# Altium schematic sheet NAND_Flash.SchDoc
size 209 x 297 mm; SheetNumber: 4; SheetTotal: 14; CmpIndex: 73; SymIndex: 29
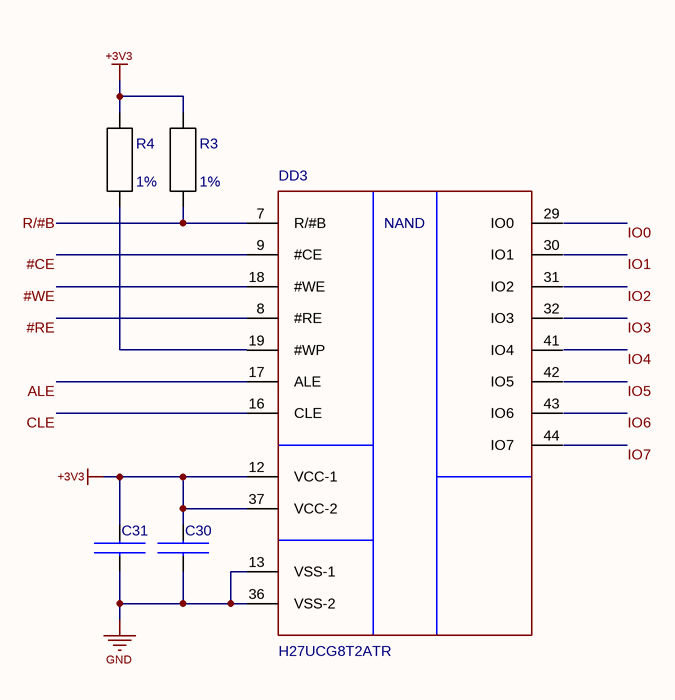
[diagram p0: NAND_Flash.SchDoc]

## Parts
C30  0402-0.1uF-50V-10%-X7R  (value not drawn)
C31  0402-0.1uF-50V-10%-X7R  (value not drawn)
DD3  H27UCG8T2ATR
R3  Tolerance: 1%  (hidden comment: 0402-10k-1%-1/16 W-100ppm)
R4  Tolerance: 1%  (hidden comment: 0402-10k-1%-1/16 W-100ppm)

## Nets
+3V3: C30.2 C31.2 DD3.12(VCC-1) DD3.37(VCC-2) R3.2 R4.2
GND: C30.1 C31.1 DD3.13(VSS-1) DD3.36(VSS-2)
#CE: DD3.9(#CE)
#RE: DD3.8(#RE)
#WE: DD3.18(#WE)
ALE: DD3.17(ALE)
CLE: DD3.16(CLE)
IO0: DD3.29(IO0)
IO1: DD3.30(IO1)
IO2: DD3.31(IO2)
IO3: DD3.32(IO3)
IO4: DD3.41(IO4)
IO5: DD3.42(IO5)
IO6: DD3.43(IO6)
IO7: DD3.44(IO7)
R/#B: DD3.7(R/#B) R3.1
NetDD3_19: DD3.19(#WP) R4.1

## Notes on the sheet
- Лист
- Изм.
- № Докум.
- Подп.
- Дата
- (in symbol H27UCG8T2ATR) NAND

## Library data of the parts
C30 = 0402-0.1uF-50V-10%-X7R: Cell Name: 0402_CAPC100X50X55L25N; CmpIndex: 19; Ref Designator: C30; SymIndex: 25; Tolerance: 10%; Orientation: 1 = 1; Part Label: 0402-0.1uF-50V-10%-X7R; Part Name: 0402-0.1uF-50V-10%-X7R; Part Number NP: 0402-0.1uF-50V-10%-X7R; Part Number: 0402-0.1uF-50V-10%-X7R
C31 = 0402-0.1uF-50V-10%-X7R: Cell Name: 0402_CAPC100X50X55L25N; CmpIndex: 20; Ref Designator: C31; SymIndex: 25; Tolerance: 10%; Orientation: 1 = 1; Part Label: 0402-0.1uF-50V-10%-X7R; Part Name: 0402-0.1uF-50V-10%-X7R; Part Number NP: 0402-0.1uF-50V-10%-X7R; Part Number: 0402-0.1uF-50V-10%-X7R
DD3 = H27UCG8T2ATR: CmpIndex: 6; DXDB_LIBNAME: Memory NAND; Ref Designator: DD3; SymIndex: 11; Orientation: 0 = 0; Part Label: H27UCG8T2ATR; Part Name: H27UCG8T2ATR; Part Number NP: H27UCG8T2ATR; Part Number: H27UCG8T2ATR
R3 = 0402-10k-1%-1/16 W-100ppm: Cell Name: 0402_RESC100X50X35L25N; CmpIndex: 4; DXDB_LIBNAME: Resistors Surface Mount; Ref Designator: R3; SymIndex: 13; Orientation: 1 = 1; Part Label: 0402-10k-1%-1/16 W-100ppm; Part Name: 0402-10k-1%-1/16 W-100ppm; Part Number NP: 0402-10k-1%-1/16 W-100ppm; Part Number: 0402-10k-1%-1/16 W-100ppm
R4 = 0402-10k-1%-1/16 W-100ppm: Cell Name: 0402_RESC100X50X35L25N; CmpIndex: 5; DXDB_LIBNAME: Resistors Surface Mount; Ref Designator: R4; SymIndex: 13; Orientation: 1 = 1; Part Label: 0402-10k-1%-1/16 W-100ppm; Part Name: 0402-10k-1%-1/16 W-100ppm; Part Number NP: 0402-10k-1%-1/16 W-100ppm; Part Number: 0402-10k-1%-1/16 W-100ppm